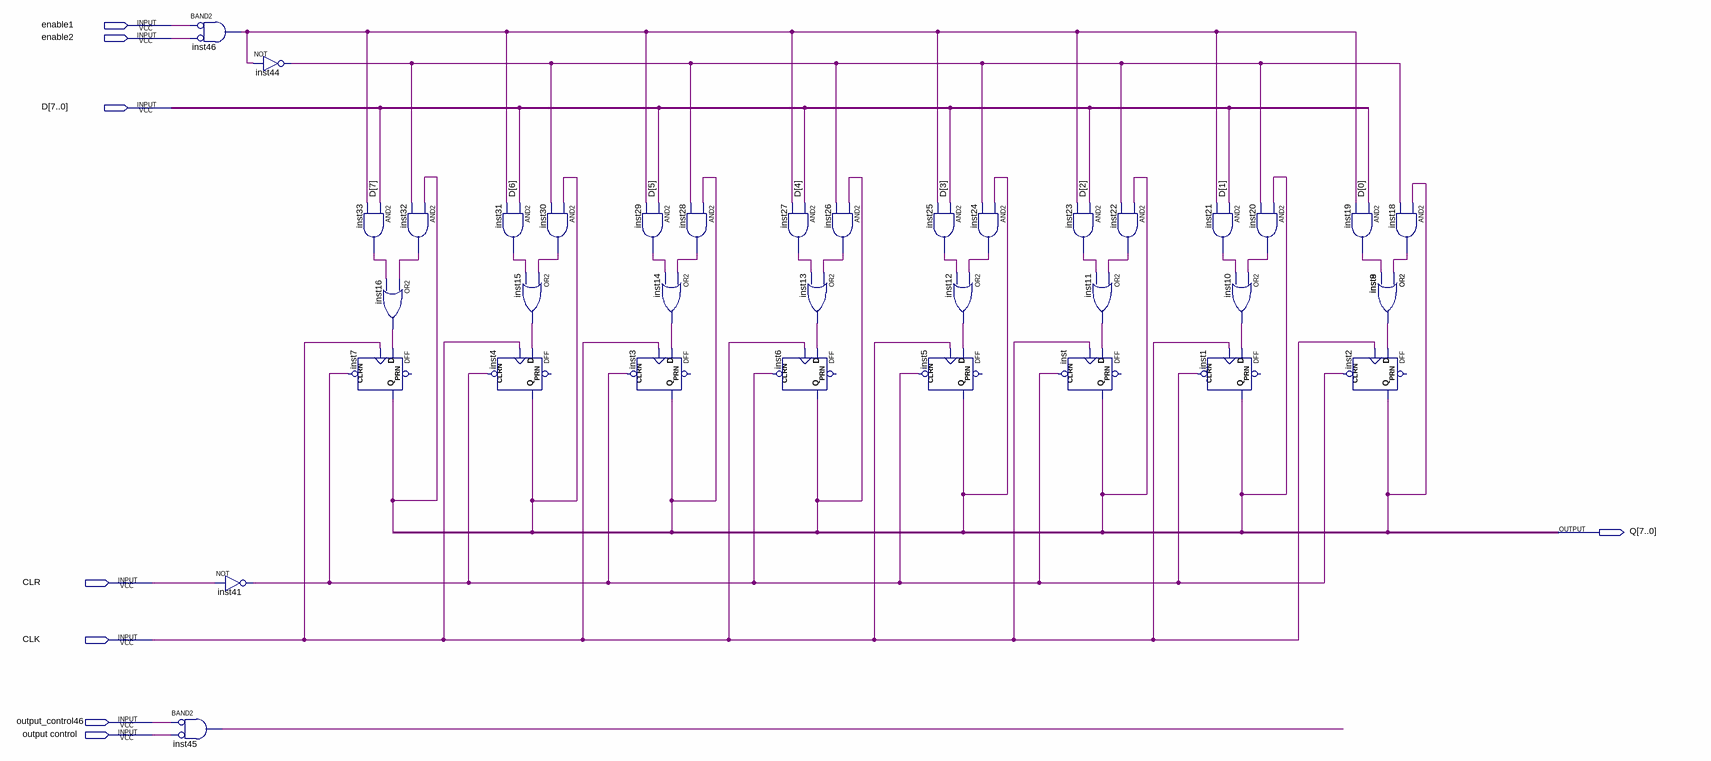
[diagram p0: schematic sheet]
// Quartus schematic Neander.bdf as structural Verilog: 37 symbols, 8 pins
module Neander (
  input  enable1,
  input  enable2,
  input  [7:0] D,
  input  CLR,
  input  CLK,
  input  output_control46,
  input  \output_control ,
  output [7:0] Q
);

  wire inst1_q, inst2_q, inst3_q, inst4_q, inst5_q, inst6_q, inst7_q, inst8_out, inst10_out, inst11_out,
       inst12_out, inst13_out, inst14_out, inst15_out, inst16_out, inst18_out, inst19_out, inst20_out,
       inst21_out, inst22_out, inst23_out, inst24_out, inst25_out, inst26_out, inst27_out, inst28_out,
       inst29_out, inst30_out, inst31_out, inst32_out, inst33_out, inst41_out, inst44_out, inst45_out,
       inst46_out, inst_q;

  and inst45 (inst45_out, ~output_control46, ~\output_control );  // BAND2
  and inst46 (inst46_out, ~enable1, ~enable2);  // BAND2
  not inst41 (inst41_out, CLR);
  not inst44 (inst44_out, inst46_out);
  and inst33 (inst33_out, D[7], inst46_out);
  or inst16 (inst16_out, inst32_out, inst33_out);
  DFF inst7 (.CLRN(inst41_out), .CLK(CLK), .D(inst16_out), .Q(inst7_q));  // open: PRN
  and inst32 (inst32_out, inst7_q, inst44_out);
  and inst31 (inst31_out, D[6], inst46_out);
  or inst15 (inst15_out, inst30_out, inst31_out);
  DFF inst4 (.CLRN(inst41_out), .CLK(CLK), .D(inst15_out), .Q(inst4_q));  // open: PRN
  and inst30 (inst30_out, inst4_q, inst44_out);
  and inst29 (inst29_out, D[5], inst46_out);
  DFF inst3 (.CLRN(inst41_out), .CLK(CLK), .D(inst14_out), .Q(inst3_q));  // open: PRN
  and inst28 (inst28_out, inst3_q, inst44_out);
  or inst14 (inst14_out, inst28_out, inst29_out);
  and inst27 (inst27_out, D[4], inst46_out);
  DFF inst6 (.CLRN(inst41_out), .CLK(CLK), .D(inst13_out), .Q(inst6_q));  // open: PRN
  and inst26 (inst26_out, inst6_q, inst44_out);
  or inst13 (inst13_out, inst26_out, inst27_out);
  and inst25 (inst25_out, D[3], inst46_out);
  DFF inst5 (.CLRN(inst41_out), .CLK(CLK), .D(inst12_out), .Q(inst5_q));  // open: PRN
  and inst24 (inst24_out, inst5_q, inst44_out);
  or inst12 (inst12_out, inst24_out, inst25_out);
  and inst23 (inst23_out, D[2], inst46_out);
  or inst11 (inst11_out, inst22_out, inst23_out);
  DFF inst (.CLRN(inst41_out), .CLK(CLK), .D(inst11_out), .Q(inst_q));  // open: PRN
  and inst22 (inst22_out, inst_q, inst44_out);
  and inst21 (inst21_out, D[1], inst46_out);
  or inst10 (inst10_out, inst20_out, inst21_out);
  DFF inst1 (.CLRN(inst41_out), .CLK(CLK), .D(inst10_out), .Q(inst1_q));  // open: PRN
  and inst20 (inst20_out, inst1_q, inst44_out);
  and inst19 (inst19_out, D[0], inst46_out);
  DFF inst2 (.CLRN(inst41_out), .CLK(CLK), .D(inst8_out), .Q(inst2_q));  // open: PRN
  and inst18 (inst18_out, inst2_q, inst44_out);
  or inst8 (inst8_out, inst18_out, inst19_out);
  or inst9 (inst8_out, inst18_out, inst19_out);
endmodule
